# Altium project SDP_21.PrjPcb
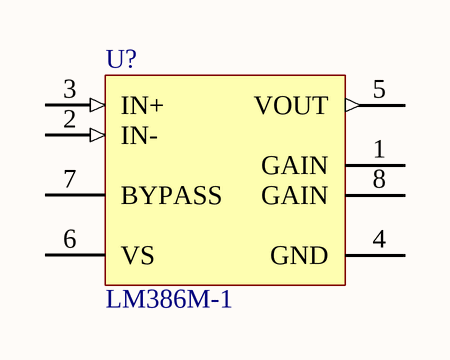
[diagram p0: Amplifier.SchDoc]
2 sheets, 2 parts. Net scope: global (net labels, ports and power ports of the same name join across sheets).
Sheets:
  Amplifier.SchDoc
  BluetoothToPhone.SchDoc

## Sheet Amplifier.SchDoc
size B

### Parts
U?  LM386M-1  [D0008A_M]

### Nets

Not connected (* = marked no-connect by the designer): U? 1(GAIN) 2(IN-) 3(IN+) 4(GND) 5(VOUT) 6(VS) 7(BYPASS) 8(GAIN)

### Notes on the sheet
- Title
- Size:
- Date:
- B
- Number:
- Time:
- Revision:
- Sheet
- of
- File:

### Library data of the parts
U? = CMP-0057-00421-4: Low Voltage Audio Power Amplifier, 8-pin Narrow SOIC; Manufacturer: Texas Instruments; PackageTopMarking: NSZXTT*LM386*M-1; CompType: Audio IC; PowerWise: N; ComponentLink1Description: Datasheet URL; Code_IPC: SOIC127P600-8; PackageDescription: SOIC Narrow, 4.9 x 3.9 x 1.45mm, 8 Lead, 1.27mm Pitch; Code_JEDEC: MS-012-AA; PinCount: 8; ComponentLink1URL: http://www.ti.com/general/docs/lit/getliterature.tsp?genericPartNumber=LM386&fileType=pdf; RoHS: N; PackageReference: D0008A

## Sheet BluetoothToPhone.SchDoc
size B
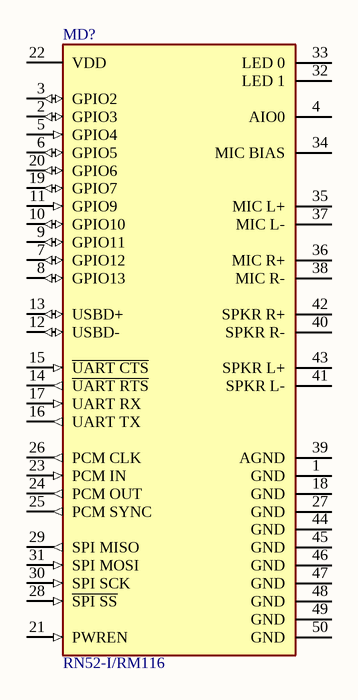
[diagram p1: BluetoothToPhone.SchDoc]

### Parts
MD?  RN52-I/RM116  [FP-RN52-I-RM116-MFG]

### Nets

Not connected (* = marked no-connect by the designer): MD? 1(GND) 2(GPIO3) 3(GPIO2) 4(AIO0) 5(GPIO4) 6(GPIO5) 7(GPIO12) 8(GPIO13) 9(GPIO11) 10(GPIO10) 11(GPIO9) 12(USBD-) 13(USBD+) 14(~{UART_RTS}) 15(~{UART_CTS}) 16(UART_TX) 17(UART_RX) 18(GND) 19(GPIO7) 20(GPIO6) 21(PWREN) 22(VDD) 23(PCM_IN) 24(PCM_OUT) 25(PCM_SYNC) 26(PCM_CLK) 27(GND) 28(~{SPI_SS}) 29(SPI_MISO) 30(SPI_SCK) 31(SPI_MOSI) 32(LED_1) 33(LED_0) 34(MIC_BIAS) 35(MIC_L+) 36(MIC_R+) 37(MIC_L-) 38(MIC_R-) 39(AGND) 40(SPKR_R-) 41(SPKR_L-) 42(SPKR_R+) 43(SPKR_L+) 44(GND) 45(GND) 46(GND) 47(GND) 48(GND) 49(GND) 50(GND)

### Notes on the sheet
- Title
- Size:
- Date:
- B
- Number:
- Time:
- Revision:
- Sheet
- of
- File:

### Library data of the parts
MD? = CMP-06331-000013-1: RF TXRX MOD BLUETOOTH TRACE ANT; Manufacturer: Microchip; Bandwidth: 80MHz; Min Supply Voltage: 3V; Data Rate: 3Mbits/s; Description: Bluetooth Bluetooth v3.0, Class 2 Transceiver Module 2.4GHz Integrated, Trace Surface Mount; Sensitivity: -85dBm; Max Supply Voltage: 3.6V; Number Of Gpio: 11; Number Of Adc Channels: 2; Max Frequency: 2.48GHz; Interface: SPI,UART,USB,I2S,Other; Mouser Description: Bluetooth 3.0 class 2 surface mount audio module with PCB trace antenna; Device Class L2: RF Semiconductors and Devices; Height: 2.8mm; Manufacturer Part Number: RN52-I/RM116; Device Class L1: Integrated Circuits (ICs); Temperature Range High: +85°C; RoHS: TRUE; Category: UNK; Octopart: https://octopart.com/rn52-i%2Frm116-microchip-47106603; Lead Free: Yes; ComponentLink2URL: http://www.microchip.com/mymicrochip/filehandler.aspx?ddocname=en560769; Automotive: No; Temperature Range Low: -40°C; Package: 0; Digikey Description: RF TXRX MOD BLUETOOTH TRACE ANT; Temperature: -40°C to +85°C; ComponentLink2Description: Datasheet; Device Class L3: Transceivers